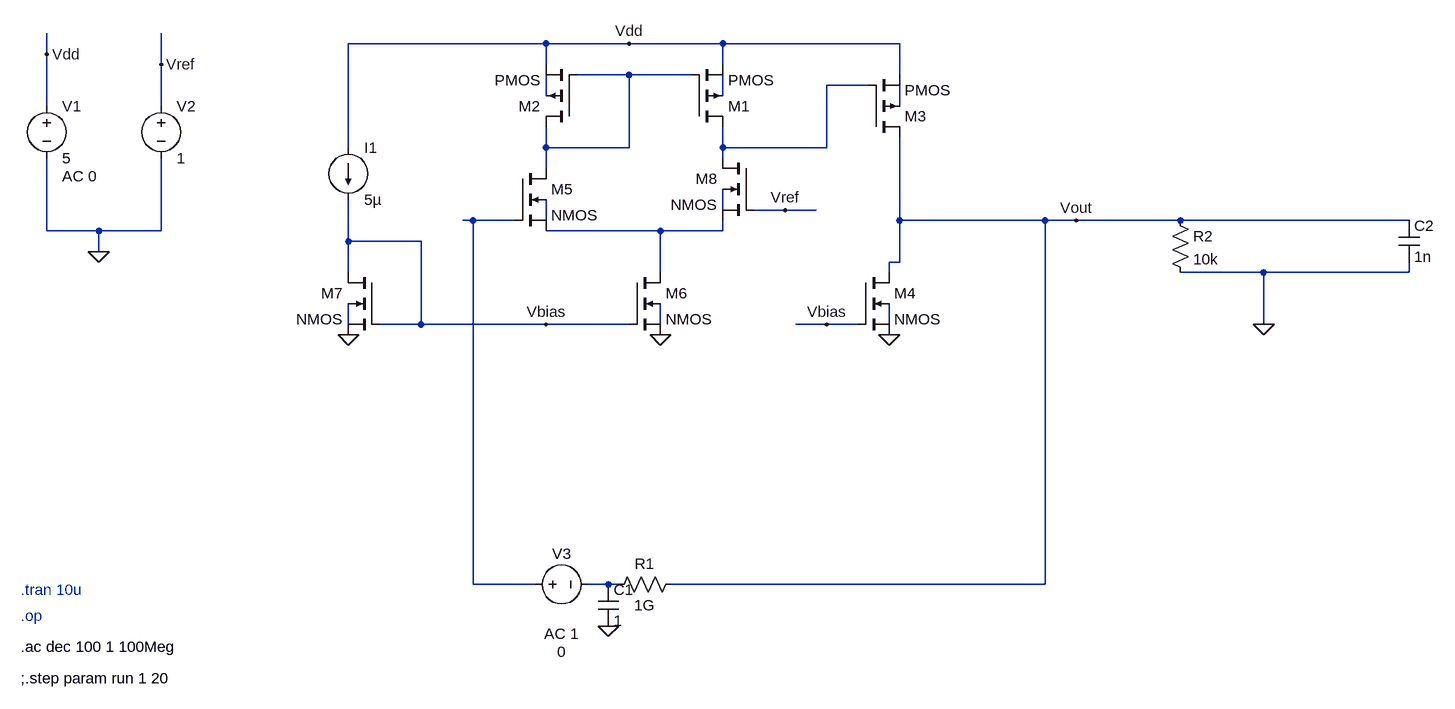
[diagram p0: schematic Synergy.asc]
Synergy.asc, the LTspice schematic file:
Version 4
SHEET 1 1420 1236
WIRE 16 0 -288 0
WIRE 144 0 16 0
WIRE 288 0 144 0
WIRE 560 0 288 0
WIRE -752 16 -752 -16
WIRE -576 32 -576 -16
WIRE 16 32 16 0
WIRE 288 32 288 0
WIRE 144 48 64 48
WIRE 240 48 144 48
WIRE 560 48 560 0
WIRE 512 64 448 64
WIRE 16 80 16 48
WIRE 288 80 288 48
WIRE -752 96 -752 16
WIRE -576 96 -576 32
WIRE 560 96 560 64
WIRE -288 160 -288 0
WIRE 16 160 16 128
WIRE 144 160 144 48
WIRE 144 160 16 160
WIRE 288 160 288 128
WIRE 448 160 448 64
WIRE 448 160 288 160
WIRE 288 176 288 160
WIRE 16 192 16 160
WIRE 288 256 288 224
WIRE 384 256 336 256
WIRE 432 256 384 256
WIRE -96 272 -112 272
WIRE -32 272 -96 272
WIRE 16 272 16 240
WIRE 560 272 560 144
WIRE 784 272 560 272
WIRE 832 272 784 272
WIRE 992 272 832 272
WIRE 1344 272 992 272
WIRE -752 288 -752 176
WIRE -672 288 -752 288
WIRE -576 288 -576 176
WIRE -576 288 -672 288
WIRE 192 288 16 288
WIRE 288 288 288 272
WIRE 288 288 192 288
WIRE -288 304 -288 240
WIRE -176 304 -288 304
WIRE -672 320 -672 288
WIRE 560 336 560 272
WIRE 560 336 544 336
WIRE -288 352 -288 304
WIRE 192 352 192 288
WIRE 544 352 544 336
WIRE 1120 352 992 352
WIRE 1344 352 1344 336
WIRE 1344 352 1120 352
WIRE -288 432 -288 400
WIRE -176 432 -176 304
WIRE -176 432 -240 432
WIRE 16 432 -176 432
WIRE 144 432 16 432
WIRE 192 432 192 400
WIRE 448 432 400 432
WIRE 496 432 448 432
WIRE 544 432 544 400
WIRE 1120 432 1120 352
WIRE -96 832 -96 272
WIRE 0 832 -96 832
WIRE 112 832 80 832
WIRE 128 832 112 832
WIRE 784 832 784 272
WIRE 784 832 208 832
FLAG -288 448 0
FLAG 192 448 0
FLAG 544 448 0
FLAG -672 320 0
FLAG -752 16 Vdd
FLAG 144 0 Vdd
FLAG -576 32 Vref
FLAG 384 256 Vref
FLAG 112 896 0
FLAG 16 432 Vbias
FLAG 448 432 Vbias
FLAG 1120 432 0
FLAG 832 272 Vout
DATAFLAG 192 0 ""
DATAFLAG 608 272 ""
DATAFLAG 384 256 ""
DATAFLAG -80 272 ""
DATAFLAG 96 48 ""
SYMBOL pmos4 240 128 M180
SYMATTR InstName M1
SYMATTR Value2 l=1800n w=180n
SYMBOL pmos4 64 128 R180
SYMATTR InstName M2
SYMATTR Value2 l=180n w=200n
SYMBOL nmos4 496 352 R0
SYMATTR InstName M4
SYMATTR Value2 l=2u w=600n
SYMBOL nmos4 -32 192 R0
SYMATTR InstName M5
SYMATTR Value2 l=300n w=500n
SYMBOL nmos4 144 352 R0
SYMATTR InstName M6
SYMATTR Value2 l=2u w=600n
SYMBOL nmos4 -240 352 M0
SYMATTR InstName M7
SYMATTR Value2 l=2u w=600n
SYMBOL nmos4 336 176 M0
SYMATTR InstName M8
SYMATTR Value2 l=220n w=500n
SYMBOL pmos4 512 144 M180
SYMATTR InstName M3
SYMATTR Value2 l=540n w=2m
SYMBOL current -288 160 R0
WINDOW 123 0 0 Left 0
WINDOW 39 0 0 Left 0
SYMATTR InstName I1
SYMATTR Value 5µ
SYMBOL voltage -752 80 R0
WINDOW 123 24 124 Left 2
WINDOW 39 0 0 Left 0
SYMATTR InstName V1
SYMATTR Value 5
SYMATTR Value2 AC 0
SYMBOL voltage -576 80 R0
WINDOW 123 0 0 Left 0
WINDOW 39 0 0 Left 0
SYMATTR InstName V2
SYMATTR Value 1
SYMBOL voltage -16 832 R270
WINDOW 0 32 56 VTop 2
WINDOW 3 -88 56 VBottom 2
WINDOW 123 -60 56 VBottom 2
WINDOW 39 0 0 Left 0
SYMATTR InstName V3
SYMATTR Value 0
SYMATTR Value2 AC 1
SYMBOL res 224 816 R90
WINDOW 0 0 56 VBottom 2
WINDOW 3 32 56 VTop 2
SYMATTR InstName R1
SYMATTR Value 1G
SYMBOL cap 96 832 R0
SYMATTR InstName C1
SYMATTR Value 1
SYMBOL res 976 256 R0
SYMATTR InstName R2
SYMATTR Value 10k
SYMBOL cap 1328 272 R0
SYMATTR InstName C2
SYMATTR Value 1n
TEXT -792 928 Left 2 !.ac dec 100 1 100Meg
TEXT -792 880 Left 2 ;.op
TEXT -792 840 Left 2 ;.tran 10u
TEXT -792 976 Left 2 !;.step param run 1 20

The netlist it stands for:
* Synergy.asc
M1 N002 N001 Vdd N004 PMOS l=1800n w=180n
M2 N001 N001 Vdd N003 PMOS l=180n w=200n
M4 Vout Vbias 0 N012 NMOS l=2u w=600n
M5 N001 N007 N009 N008 NMOS l=300n w=500n
M6 N009 Vbias 0 N011 NMOS l=2u w=600n
M7 Vbias Vbias 0 N010 NMOS l=2u w=600n
M8 N002 Vref N009 N006 NMOS l=220n w=500n
M3 Vout N002 Vdd N005 PMOS l=540n w=2m
I1 Vdd Vbias 5µ
V1 Vdd 0 5 AC 0
V2 Vref 0 1
V3 N007 N013 0 AC 1
R1 Vout N013 1G
C1 N013 0 1
R2 Vout 0 10k
C2 Vout 0 1n
.model NMOS NMOS
.model PMOS PMOS
.lib standard.mos
.ac dec 100 1 100Meg
* .op
* .tran 10u
;.step param run 1 20
.backanno
.end